# EAGLE design OhEye (EAGLE 6.2)
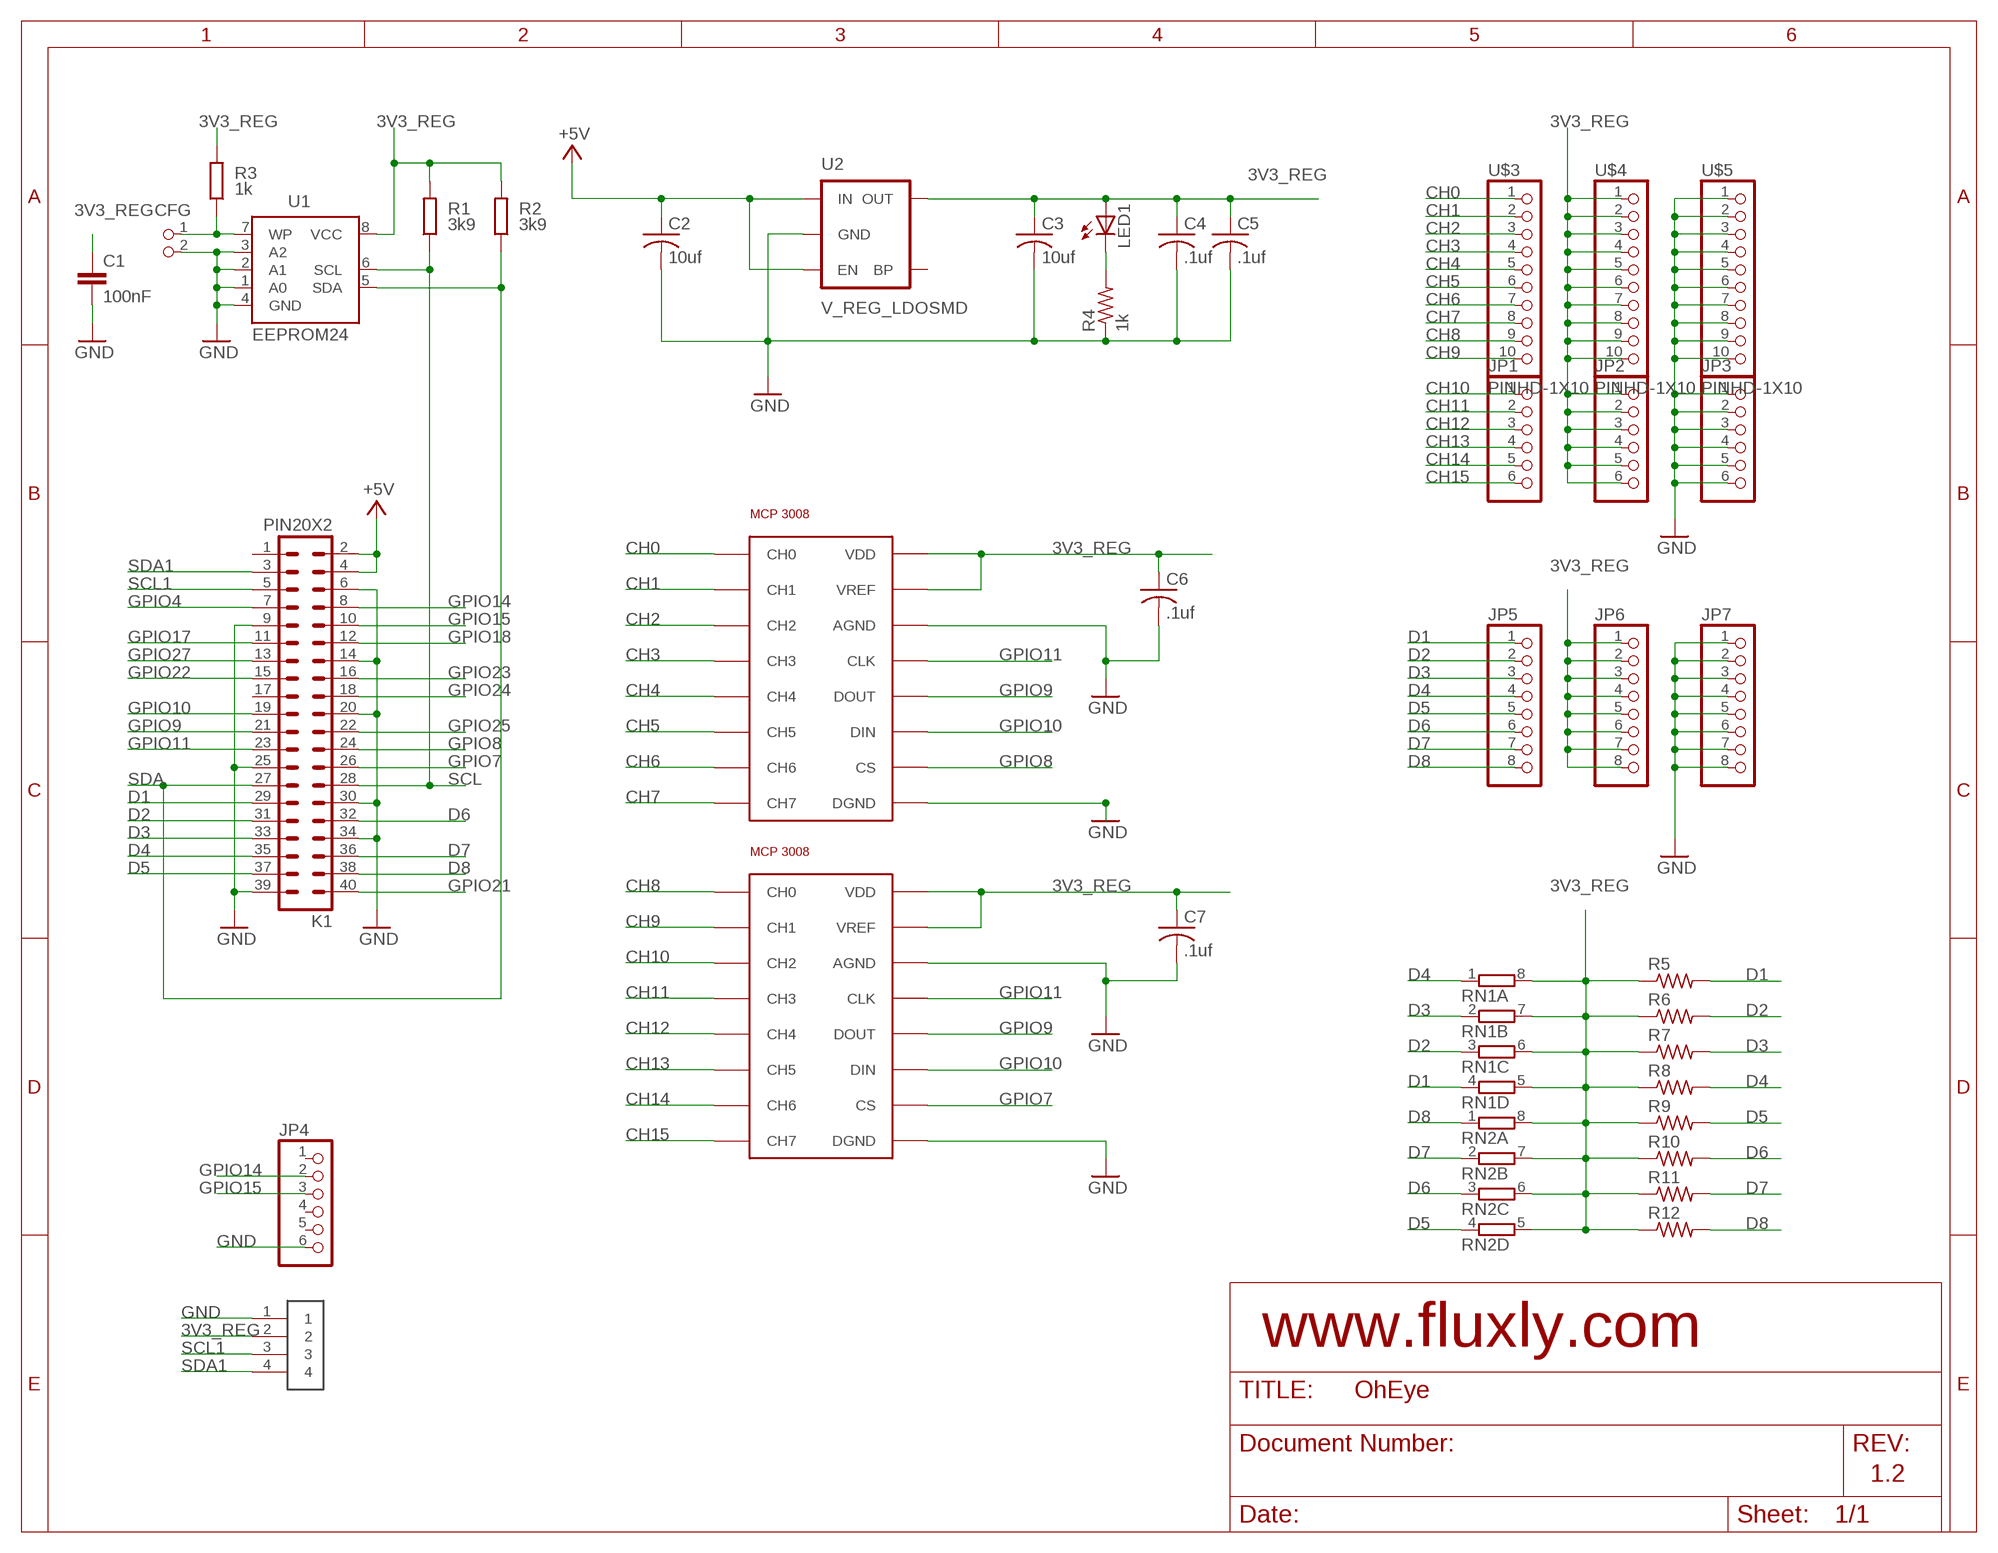
[diagram p0: schematic, sheet 1]

## Parts
C1  100nF  C-EUC0805K  [C0805K]
C2  10uf  C-USC0805K  [C0805K]
C3  10uf  C-USC0805K  [C0805K]
C4  .1uf  C-USC0805K  [C0805K]
C5  .1uf  C-USC0805K  [C0805K]
C6  .1uf  C-USC0805K  [C0805K]
C7  .1uf  C-USC0805K  [C0805K]
CFG  PIN2_100  [PIN_W_2]
JP1  PINHD-1X6B  [1X06-BIG]
JP2  PINHD-1X6B  [1X06-BIG]
JP3  PINHD-1X6B  [1X06-BIG]
JP4  PINHD-1X6B  [1X06-BIG]
JP5  PINHD-1X8BIG  [1X08-BIG]
JP6  PINHD-1X8BIG  [1X08-BIG]
JP7  PINHD-1X8BIG  [1X08-BIG]
K1  PIN20X2  [PIN_20X2]
LED1  LEDLED-0805  [LED0805.PAC]
R1  3k9  R-EU_M0805  [M0805]
R2  3k9  R-EU_M0805  [M0805]
R3  1k  R-EU_M0805  [M0805]
R4  1k  R-US_R0805W  [R0805W]
R5  R-US_0207/10  [0207/10]
R6  R-US_0207/10  [0207/10]
R7  R-US_0207/10  [0207/10]
R8  R-US_0207/10  [0207/10]
R9  R-US_0207/10  [0207/10]
R10  R-US_0207/10  [0207/10]
R11  R-US_0207/10  [0207/10]
R12  R-US_0207/10  [0207/10]
RN1  REISTOR_4NETEXBS8V  [EXBS8V]
RN2  REISTOR_4NETEXBS8V  [EXBS8V]
U1  EEPROM24  [SOIC8]
U2  V_REG_LDOSMD  [SOT23-5]
U$1  MCP3008_ADC  [SOIC16]
U$2  MCP3008_ADC  [SOIC16]
U$3  PINHD-1X10  [1X10-BIG]
U$4  PINHD-1X10  [1X10-BIG]
U$5  PINHD-1X10  [1X10-BIG]
U$9  1X4_CLEAN  [1X4_CLEAN]

## Nets
3V3_REG: C1.1 C3.1 C4.1 C5.1 C6.1 C7.1 JP2.1 JP2.2 JP2.3 JP2.4 JP2.5 JP2.6 JP6.1 JP6.2 JP6.3 JP6.4 JP6.5 JP6.6 JP6.7 JP6.8 LED1.A R1.2 R2.2 R3.2 R5.1 R6.1 R7.1 R8.1 R9.1 R10.1 R11.1 R12.1 RN1.5 RN1.6 RN1.7 RN1.8 RN2.5 RN2.6 RN2.7 RN2.8 U1.8(VCC) U2.5(OUT) U$1.P$15(VREF) U$1.P$16(VDD) U$2.P$15(VREF) U$2.P$16(VDD) U$4.1 U$4.2 U$4.3 U$4.4 U$4.5 U$4.6 U$4.7 U$4.8 U$4.9 U$4.10 U$9.2
+5V: C2.1 K1.2 K1.4 U2.1(IN) U2.3(EN)
CH0: U$1.P$1(CH0) U$3.1
CH1: U$1.P$2(CH1) U$3.2
CH2: U$1.P$3(CH2) U$3.3
CH3: U$1.P$4(CH3) U$3.4
CH4: U$1.P$5(CH4) U$3.5
CH5: U$1.P$6(CH5) U$3.6
CH6: U$1.P$7(CH6) U$3.7
CH7: U$1.P$8(CH7) U$3.8
CH8: U$2.P$1(CH0) U$3.9
CH9: U$2.P$2(CH1) U$3.10
CH10: JP1.1 U$2.P$3(CH2)
CH11: JP1.2 U$2.P$4(CH3)
CH12: JP1.3 U$2.P$5(CH4)
CH13: JP1.4 U$2.P$6(CH5)
CH14: JP1.5 U$2.P$7(CH6)
CH15: JP1.6 U$2.P$8(CH7)
D1: JP5.1 K1.29 R5.2 RN1.4
D2: JP5.2 K1.31 R6.2 RN1.3
D3: JP5.3 K1.33 R7.2 RN1.2
D4: JP5.4 K1.35 R8.2 RN1.1
D5: JP5.5 K1.37 R9.2 RN2.4
D6: JP5.6 K1.32 R10.2 RN2.3
D7: JP5.7 K1.36 R11.2 RN2.2
D8: JP5.8 K1.38 R12.2 RN2.1
GND: C1.2 C2.2 C3.2 C4.2 C5.2 C6.2 C7.2 CFG.2 JP3.1 JP3.2 JP3.3 JP3.4 JP3.5 JP3.6 JP4.6 JP7.1 JP7.2 JP7.3 JP7.4 JP7.5 JP7.6 JP7.7 JP7.8 K1.6 K1.9 K1.14 K1.20 K1.25 K1.30 K1.34 K1.39 R4.1 U1.1(A0) U1.2(A1) U1.3(A2) U1.4(GND) U2.2(GND) U$1.P$9(DGND) U$1.P$14(AGND) U$2.P$9(DGND) U$2.P$14(AGND) U$5.1 U$5.2 U$5.3 U$5.4 U$5.5 U$5.6 U$5.7 U$5.8 U$5.9 U$5.10 U$9.1
GPIO4: K1.7
GPIO7: K1.26 U$2.P$10(CS)
GPIO8: K1.24 U$1.P$10(CS)
GPIO9: K1.21 U$1.P$12(DOUT) U$2.P$12(DOUT)
GPIO10: K1.19 U$1.P$11(DIN) U$2.P$11(DIN)
GPIO11: K1.23 U$1.P$13(CLK) U$2.P$13(CLK)
GPIO14: JP4.2 K1.8
GPIO15: JP4.3 K1.10
GPIO17: K1.11
GPIO18: K1.12
GPIO21: K1.40
GPIO22: K1.15
GPIO23: K1.16
GPIO24: K1.18
GPIO25: K1.22
GPIO27: K1.13
N$3: CFG.1 R3.1 U1.7(WP)
N$8: LED1.K(C) R4.2
SCL: K1.28 R1.1 U1.6(SCL)
SCL1: K1.5 U$9.3
SDA: K1.27 R2.1 U1.5(SDA)
SDA1: K1.3 U$9.4
Unconnected: JP4.1 JP4.4 JP4.5 K1.1 K1.17 U2.4(BP)

## Notes on the sheet
- www.fluxly.com
- 1.2

## Library data of the parts
C1 = resistor:C-EU: CAPACITOR, European symbol; DIELECTRIC: X7R
C2-C7 = ModernDevice:C-US: CAPACITOR, American symbol
CFG = FLYFISH:PIN2
JP1-JP4 = adafruit:PINHD-1X6: PIN HEADER
JP5-JP7 = adafruit:PINHD-1X8: PIN HEADER
K1 = FLYFISH:PIN20X2
LED1 = ModernDevice:LED: LEDs Standard schematic elements and footprints for 5mm, 3mm, 1206, and 0603 sized LEDs. 5mm - Spark Fun Electronics SKU : COM-00529 (and others)
R1-R3 = resistor:R-EU_: RESISTOR, European symbol; TOLERANCE: 5%
R4 = ModernDevice:R-US_: RESISTOR, American symbol
R5-R12 = adafruit:R-US_: RESISTOR, American symbol
RN1 RN2 = ModernDevice:REISTOR_4NET: Array Chip Resistor Source: RS Component / Phycomp; OC_FARNELL: unknown; OC_NEWARK: unknown
U1 = FLYFISH:EEPROM24
U2 = ModernDevice:V_REG_LDO: Voltage Regulator LDO Standard 150mA LDO voltage regulator in SOT-23 layout. Micrel part MIC5205. BP (by-pass) pin is used to lower output noise with 470pF cap.
U$1 U$2 = ModernDevice:MCP3008_ADC
U$3-U$5 = adafruit:PINHD-1X10: Pin header 1x10 0.1" spacing With round pins
U$9 = ModernDevice:1X4_CLEAN

## Board
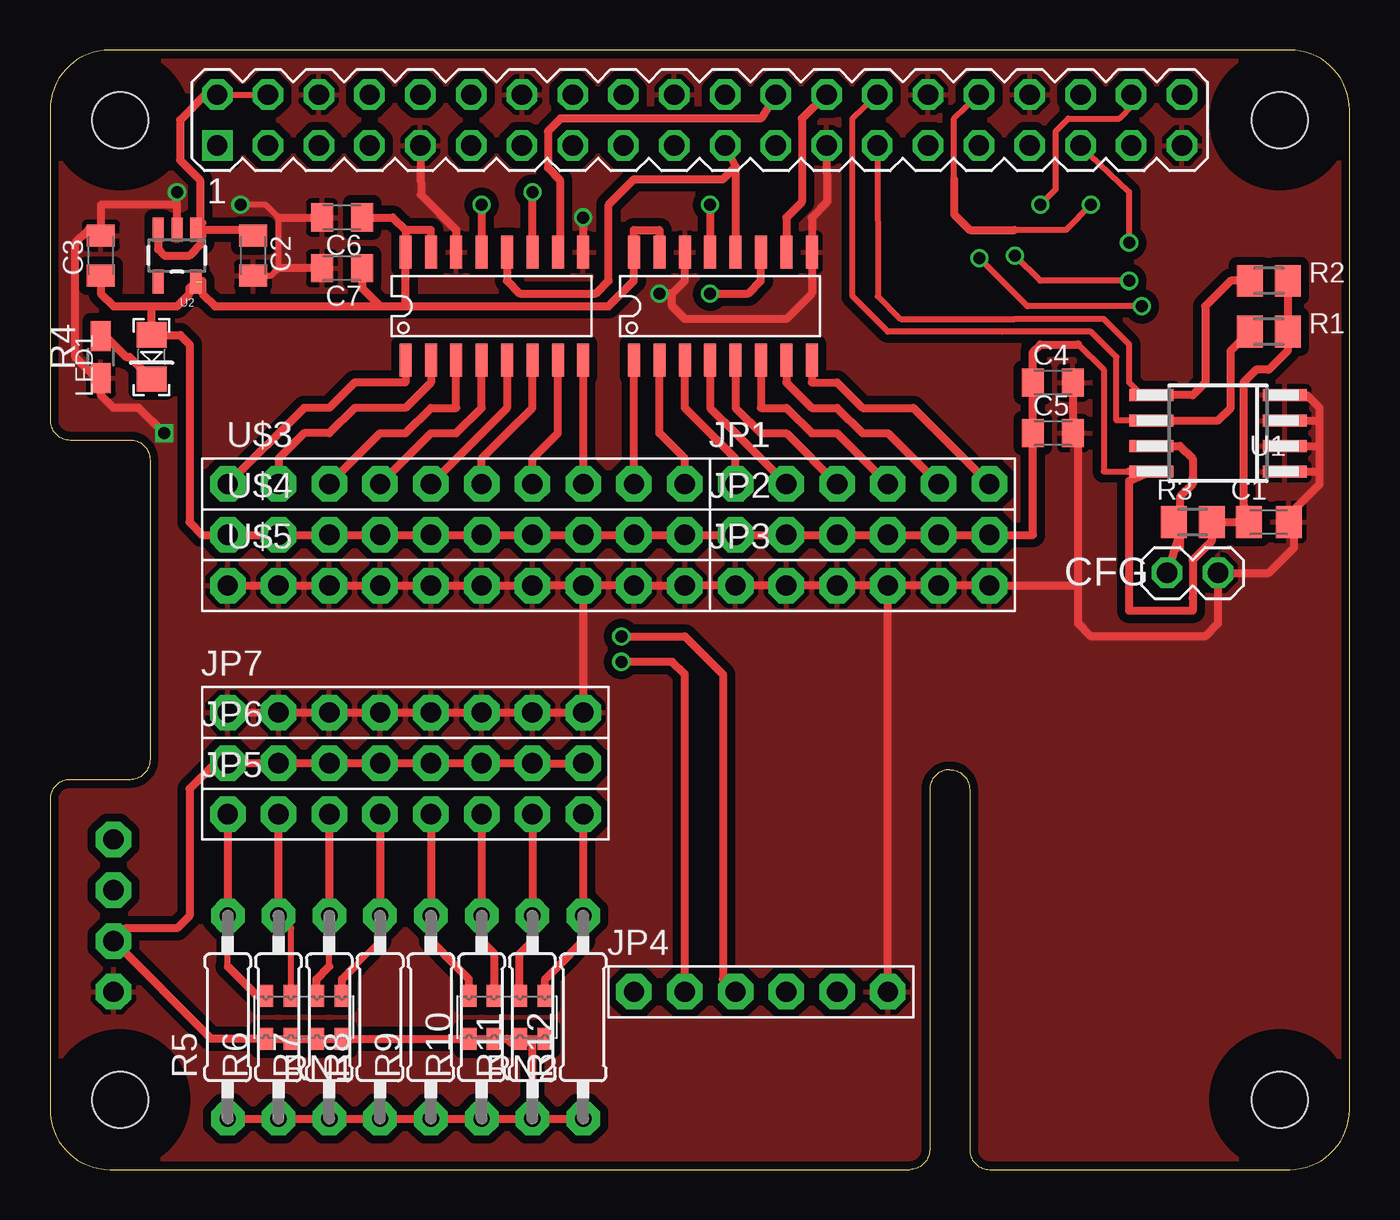
[diagram p1: board, top side]
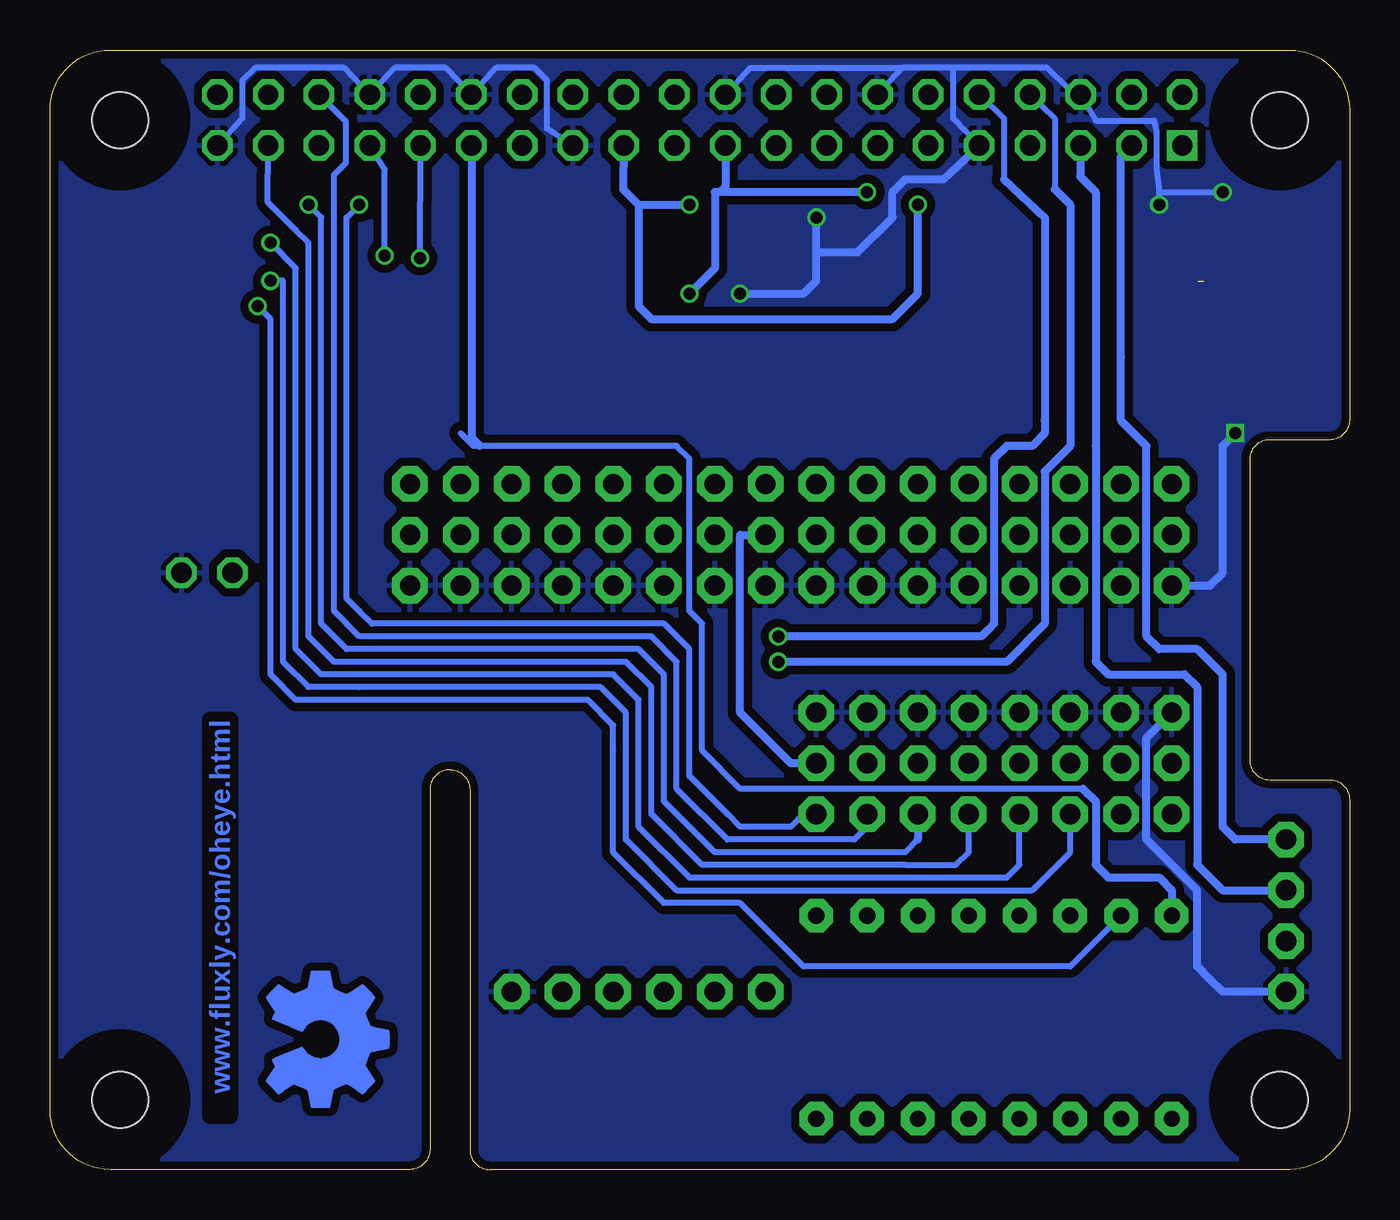
[diagram p2: board, bottom side, seen from below]

Size 65 x 56 mm. Coordinates in mm from the lower left corner, seen from the top.
Outline: 0,3 arc90 3,0 43,0 arc90 44,1 44,19 arc-90 45,20 arc-90 46,19 46,1 arc90 47,0 62,0 arc90 65,3 65,53 arc90 62,56 3,56 arc90 0,53 0,37.5 arc90 1,36.5 4,36.5 arc-90 5,35.5 5,20.5 arc-90 4,19.5 1,19.5 arc90 0,18.5 0,3
Copper layers (1*16): Top 0.035mm / dielectric 1.5mm / Bottom 0.035mm
Design rules: minimum track width 6mil, minimum drill 12mil, track to track 6mil, track to pad 6mil, pad to pad 6mil, via to via 6mil, smd to smd 0mil, copper to edge 10mil, drill to drill 10mil, minimum pad ring 10mil, minimum via ring 6mil, stop-mask expansion 10mil, vias tented up to drill 100mil, thermal gap 10mil
Holes 2.8 mm at 3.5,3.5 3.5,52.5 61.5,52.5 61.5,3.5
tRestrict: area 1.9,51 to 5,54; area 60,51 to 63,54; area 60,1.9 to 63,5; area 1.9,1.9 to 5,5
bRestrict: area 1.9,1.9 to 5,5; area 1.9,51 to 5,54; area 60,1.9 to 63,5; area 60,51 to 63,54

### Footprints (pad centres in the part's own frame; a part is rotated, then mirrored left to right if it is on the bottom)
C0805K = smd 1.3 x 1.6: 1 -1,0; 2 1,0
C0805K' = smd 1.1 x 1.4: 1 -1,0; 2 1,0
PIN_W_2 = drill 1.016 octagon: 1 0,0; 2 0,-2.54
1X06-BIG = drill 1.016 pad 1.778 octagon: 1 -6.35,0; 2 -3.81,0; 3 -1.27,0; 4 1.27,0; 5 3.81,0; 6 6.35,0
1X08-BIG = drill 1.016 pad 1.778 octagon: 1 -8.89,0; 2 -6.35,0; 3 -3.81,0; 4 -1.27,0; 5 1.27,0; 6 3.81,0; 7 6.35,0; 8 8.89,0
PIN_20X2 = drill 1.016 square: 1 -24.13,-1.27 | drill 1.016 octagon: 2 -24.13,1.27; 3 -21.59,-1.27; 4 -21.59,1.27; 5 -19.05,-1.27; 6 -19.05,1.27; 7 -16.51,-1.27; 8 -16.51,1.27; 9 -13.97,-1.27; 10 -13.97,1.27; 11 -11.43,-1.27; 12 -11.43,1.27; 13 -8.89,-1.27; 14 -8.89,1.27; 15 -6.35,-1.27; 16 -6.35,1.27; 17 -3.81,-1.27; 18 -3.81,1.27; 19 -1.27,-1.27; 20 -1.27,1.27; 21 1.27,-1.27; 22 1.27,1.27; 23 3.81,-1.27; 24 3.81,1.27; 25 6.35,-1.27; 26 6.35,1.27; 27 8.89,-1.27; 28 8.89,1.27; 29 11.43,-1.27; 30 11.43,1.27; 31 13.97,-1.27; 32 13.97,1.27; 33 16.51,-1.27; 34 16.51,1.27; 35 19.05,-1.27; 36 19.05,1.27; 37 21.59,-1.27; 38 21.59,1.27; 39 24.13,-1.27; 40 24.13,1.27
LED0805.PAC = smd 1.27 x 1.5: A 1.104,0; K -1.104,0
M0805 = smd 1.3 x 1.6: 1 -0.95,0; 2 0.95,0
R0805W = smd 1.5 x 1: 1 -1.052,0; 2 1.052,0
0207/10 = drill 0.813 pad 1.676 octagon: 1 -5.08,0; 2 5.08,0
EXBS8V = smd 0.75 x 1.1: 1 -1.905,-1.07; 2 -0.635,-1.07; 3 0.635,-1.07; 4 1.905,-1.07; 5 1.905,1.07; 6 0.635,1.07; 7 -0.635,1.07; 8 -1.905,1.07
SOIC8 = smd 0.6 x 2.2: 1 -1.905,-3.33; 2 -0.635,-3.33; 3 0.635,-3.33; 4 1.905,-3.33; 5 1.905,3.33; 6 0.635,3.33; 7 -0.635,3.33; 8 -1.905,3.33
SOT23-5 = smd 0.55 x 1.2: 1 -0.95,-1.3; 2 0,-1.3; 3 0.95,-1.3; 4 0.95,1.3; 5 -0.95,1.3
SOIC16 = smd 1.65 x 0.6: P$1 -2.7,3.81; P$2 -2.7,2.54; P$3 -2.7,1.27; P$4 -2.7,0; P$5 -2.7,-1.27; P$6 -2.7,-2.54; P$7 -2.7,-3.81; P$8 -2.7,-5.08; P$9 2.7,-5.08; P$10 2.7,-3.81; P$11 2.7,-2.54; P$12 2.7,-1.27; P$13 2.7,0; P$14 2.7,1.27; P$15 2.7,2.54; P$16 2.7,3.81
1X10-BIG = drill 1.016 pad 1.778 octagon: 1 -11.43,0; 2 -8.89,0; 3 -6.35,0; 4 -3.81,0; 5 -1.27,0; 6 1.27,0; 7 3.81,0; 8 6.35,0; 9 8.89,0; 10 11.43,0
1X4_CLEAN = drill 1.016 pad 1.778 octagon: 1 -3.81,0; 2 -1.27,0; 3 1.27,0; 4 3.81,0

### Placement (x,y rotation side)
C1  60.96,32.38 0 top
C2  10uf  [C0805K']  10.16,45.72 270 top
C3  10uf  [C0805K']  2.54,45.72 90 top
C4  .1uf  [C0805K']  50.16,39.37 0 top
C5  .1uf  [C0805K']  50.16,36.83 0 top
C6  .1uf  [C0805K']  14.61,47.62 180 top
C7  .1uf  [C0805K']  14.61,45.09 180 top
CFG  55.88,29.84 90 top
JP1  40.64,34.29 0 top
JP2  40.64,31.75 0 top
JP3  40.64,29.21 0 top
JP4  35.56,8.89 0 top
JP5  17.78,17.78 0 top
JP6  17.78,20.32 0 top
JP7  17.78,22.86 0 top
K1  32.49,52.49 0 top
LED1  5.08,40.64 90 top
R1  60.96,41.91 0 top
R2  60.96,44.45 0 top
R3  57.15,32.38 0 top
R4  2.54,40.64 90 top
R5  8.89,7.62 90 top
R6  11.43,7.62 90 top
R7  13.97,7.62 90 top
R8  16.51,7.62 90 top
R9  19.05,7.62 90 top
R10  21.59,7.62 90 top
R11  24.13,7.62 90 top
R12  26.67,7.62 90 top
RN1  12.7,7.62 180 top
RN2  22.86,7.62 180 top
U1  58.42,36.83 90 top
U2  6.35,45.72 180 top
U$1  21.59,43.18 90 top
U$2  33.02,43.18 90 top
U$3  20.32,34.29 0 top
U$4  20.32,31.75 0 top
U$5  20.32,29.21 0 top
U$9  3.17,12.7 90 top

### Tracks (layer width: path | path; a pad name or v marks a point on that pad's centre or on a via)
3V3_REG  (1 unrouted)
  Top 0.305: 51.44,41.27 52.7,40.01 52.7,34.92 53.98,34.92
  Top 0.406: JP6.8 JP6.7 JP6.6 JP6.5 JP6.4 JP6.3 JP6.2 JP6.1 8.26,20.32 6.99,19.05 6.99,12.7 6.35,12.06 3.81,12.06 U$9.2 8.05,6.55 RN1.5 RN1.6 RN1.7 RN1.8 RN2.5 RN2.6 22.86,6.55 | 22.86,6.55 RN2.7 RN2.8 | R11.1 24.13,6.35 23.06,6.35 22.86,6.55 | R5.1 R6.1 R7.1 R8.1 R9.1 R10.1 R11.1 | R11.1 R12.1 | C3.1 2.54,43.81 3.17,43.18 5.08,43.18 | 5.08,43.18 6.35,43.18 6.99,43.81 6.99,44.1 U2.5 | LED1.A 5.08,41.91 | 5.08,41.91 5.08,43.18 | LED1.A 5.08,41.91 | 7.59,44.42 7.62,44.45 7.62,43.81 8.26,43.18 16.51,43.18 | 16.51,43.18 17.78,43.18 | 17.78,43.18 27.94,43.18 29.21,44.45 U$2.P$16 29.21,46.99 30.48,46.99 U$2.P$15 | 51.44,41.27 49.53,41.27 49.16,40.91 C4.1 C5.1 49.16,31.75 JP2.6 JP2.5 JP2.4 JP2.3 JP2.2 JP2.1 U$4.10 U$4.9 U$4.8 U$4.7 U$4.6 U$4.5 U$4.4 U$4.3 U$4.2 U$4.1 7.62,31.75 6.99,32.38 6.99,41.27 6.52,41.74 LED1.A | 53.98,34.92 U1.8 53.98,34.45 53.98,29.84 53.98,27.94 57.15,27.94 57.15,28.57 57.15,30.48 57.78,31.11 58.1,31.43 R3.2 C1.1 59.69,33.29 59.69,39.37 60.33,40.01 60.96,40.01 61.91,40.95 R1.2 R2.2 | U$1.P$15 19.05,46.35 19.05,46.99 17.78,46.99 | 17.78,46.99 U$1.P$16 17.78,43.18 | C6.1 17.14,47.62 17.78,46.99 | C7.1 15.61,44.09 16.51,43.18
  Bottom 0.406: JP6.8 27.94,20.32 30.48,22.86 30.48,31.75 U$4.9
+5V
  Top 0.305: K1.2 K1.4
  Top 0.406: 7.62,47.34 U2.1 | U2.1 9.86,47.02 C2.1 | U2.3 5.4,46.03 5.71,45.72 6.99,45.72 7.62,46.35 7.62,46.7 U2.1 | K1.2 7.76,53.76 6.5,52.5 6.5,50.5 7.5,49.5 7.5,47.22 U2.1
CH0
  Top 0.406: U$1.P$1 17.78,39.37 15.24,39.37 13.97,38.1 12.7,38.1 U$3.1
CH1
  Top 0.406: U$1.P$2 19.05,39.37 17.78,38.1 15.24,38.1 13.97,36.83 12.7,36.83 11.43,35.56 U$3.2
CH2
  Top 0.406: U$3.3 16.51,36.83 17.78,36.83 19.05,38.1 20.32,38.1 U$1.P$3
CH3
  Top 0.406: U$3.4 19.05,36.83 20.32,36.83 21.59,38.1 U$1.P$4
CH4
  Top 0.406: U$1.P$5 22.86,38.1 U$3.5
CH5
  Top 0.406: U$3.6 21.59,35.56 22.86,36.83 24.13,38.1 U$1.P$6
CH6
  Top 0.406: U$3.7 24.13,35.56 25.4,36.83 U$1.P$7
CH7
  Top 0.406: U$1.P$8 U$3.8
CH8
  Top 0.406: U$3.9 U$2.P$1
CH9
  Top 0.406: U$3.10 31.75,35.56 30.48,36.83 U$2.P$2
CH10
  Top 0.406: JP1.1 34.29,35.56 31.75,38.1 U$2.P$3
CH11
  Top 0.406: U$2.P$4 33.02,38.1 34.29,36.83 JP1.2
CH12
  Top 0.406: U$2.P$5 34.29,38.1 35.56,36.83 36.83,36.83 JP1.3
CH13
  Top 0.406: U$2.P$6 35.56,38.1 36.83,38.1 38.1,36.83 39.37,36.83 JP1.4
CH14
  Top 0.406: U$2.P$7 36.83,39.37 38.1,38.1 39.37,38.1 40.64,36.83 41.91,36.83 JP1.5
CH15
  Top 0.406: U$2.P$8 38.1,39.37 39.37,39.37 40.64,38.1 43.18,38.1 JP1.6
D1
  Top 0.305: 8.89,10.16 R5.2
  Top 0.406: JP5.1 R5.2 | RN1.4 10.36,8.69 8.89,10.16
  Bottom 0.305: 13.34,19.05 30.48,19.05 32.38,20.95 32.38,27.3 33.02,27.94 33.02,35.56 33.66,36.2 43.5,36.2 43.81,36.2 44.45,36.83
  Bottom 0.406: 13.34,19.05 12.7,18.41 12.7,15.24 12.06,14.61 9.53,14.61 8.89,13.97 R5.2 | K1.29 43.92,36.62 43.5,36.2
D2  (via drill 0.6)
  Top 0.305: RN1.3 12.06,12.06 R6.2 | v54.61,43.18 48.9,43.18 v46.49,45.59
  Top 0.406: R6.2 JP5.2
  Bottom 0.305: R6.2 13.97,10.16 27.3,10.16 30.48,13.34 34.29,13.34 36.83,15.88 36.83,20.95 36.83,22.23 38.1,23.5 52.7,23.5 53.98,24.77 53.98,42.55 v54.61,43.18 | v46.49,45.59 K1.31
D3  (via drill 0.6)
  Top 0.305: 13.97,10.16 R7.2 | v53.98,44.45 49.53,44.45 v48.26,45.72
  Top 0.406: JP5.3 R7.2 | RN1.2 13.34,9.53 13.97,10.16
  Bottom 0.305: JP5.3 13.97,15.88 15.88,13.97 33.66,13.97 36.2,16.51 36.2,22.86 37.47,24.13 49.53,24.13 52.07,24.13 53.34,25.4 53.34,44.45 v53.98,44.45 | v48.26,45.72 48.26,50.03 K1.33
D4  (via drill 0.6)
  Top 0.305: 15.24,10.16 16.51,11.43 R8.2 | v53.98,46.35 53.98,48.9 K1.35
  Top 0.406: JP5.4 R8.2 | RN1.1 14.61,9.53 15.24,10.16
  Bottom 0.305: 49.53,24.77 36.83,24.77 35.56,23.5 35.56,17.14 33.02,14.61 17.78,14.61 17.14,14.61 16.51,15.24 JP5.4 | 49.53,24.77 51.44,24.77 | 49.53,24.77 51.44,24.77 | 51.44,24.77 52.7,26.04 52.7,45.09 v53.98,46.35
D5
  Top 0.406: JP5.5 R9.2 19.05,11.43 20.32,10.16 20.95,9.53 RN2.4
  Bottom 0.305: K1.37 54.11,48.4 52.7,46.99 52.07,46.35 52.07,26.67 50.8,25.4 50.16,25.4 36.2,25.4 34.92,24.13 34.92,17.78 32.38,15.24 22.23,15.24 19.68,15.24 19.05,15.88 JP5.5
D6  (via drill 0.6)
  Top 0.305: v52.07,48.26 50.8,46.99 48.26,46.99 | 45.22,49.53 45.22,52.57 K1.32
  Top 0.406: JP5.6 R10.2 21.59,11.43 22.23,10.79 RN2.3 | 45.22,49.53 45.22,47.78 46,47 48.25,47 48.26,46.99
  Bottom 0.305: 21.59,16.51 22.23,15.88 31.75,15.88 34.29,18.41 34.29,24.77 35.56,26.04 50.16,26.04 51.44,27.3 51.44,47.62 v52.07,48.26
  Bottom 0.406: JP5.6 21.59,16.51
D7
  Top 0.406: JP5.7 R11.2 24.13,11.43 23.5,10.79 RN2.2
  Bottom 0.305: 24.13,17.14 24.77,16.51 31.11,16.51 33.66,19.05 33.66,25.4 34.92,26.67 49.53,26.67 50.8,27.94 50.8,48.57 50.8,49.76 50.19,50.37 50.19,52.41 K1.36
  Bottom 0.406: JP5.7 24.13,17.14
D8  (via drill 0.6)
  Top 0.305: v49.53,48.26 50.3,49.03 50.3,51.94 50.94,52.57 53.48,52.57 54.11,53.2 K1.38
  Top 0.406: JP5.8 R12.2 26.67,11.43 25.4,10.16 24.77,9.53 RN2.1
  Bottom 0.305: JP5.8 27.3,17.78 27.94,17.14 30.48,17.14 31.11,17.78 33.02,19.68 33.02,26.04 34.29,27.3 48.9,27.3 49.53,27.94 50.16,28.57 50.16,47.62 v49.53,48.26
GND  (via drill 0.6)
  Top 0.305: v6.35,48.9 6.35,48.26 | C2.2 11.06,44.72 11.43,45.09 11.43,47.62 10.79,48.26 v9.53,48.26
  Top 0.406: C4.2 C5.2 51.44,36.56 51.44,29.21 | JP3.4 JP3.5 JP3.6 51.44,29.21 | JP3.4 JP3.3 JP3.2 JP3.1 U$5.10 U$5.9 U$5.8 | U$5.8 U$5.7 22.86,29.21 U$5.5 U$5.4 U$5.3 U$5.2 U$5.1 | JP7.1 JP7.2 JP7.3 JP7.4 JP7.5 JP7.6 JP7.7 JP7.8 U$5.8 | K1.9 18.55,48.76 20.32,46.99 U$1.P$14 20.32,45.72 | U2.2 6.35,48.26 2.54,48.26 C3.2 2.27,46.99 1.91,46.99 1.27,46.35 1.27,40.64 2.32,39.59 R4.1 2.54,38.73 3.17,38.1 4.45,38.1 v5.71,36.83 | K1.25 38.87,48.4 38.1,47.62 U$2.P$9 38.1,43.81 36.83,42.55 31.75,42.55 31.11,43.18 31.11,43.81 | 31.11,43.81 31.75,44.45 31.75,45.72 | 31.75,45.72 U$2.P$14 31.75,45.72 | 63.5,34.92 63.5,34.29 62.23,33.02 C1.2 62.23,32.12 62.23,31.11 60.96,29.84 CFG.2 58.42,27.3 57.78,26.67 52.07,26.67 51.44,27.3 51.44,29.21 | 63.5,34.92 63.5,36.2 | 63.5,36.2 63.5,37.47 | 63.5,37.47 63.5,38.1 62.87,38.73 U1.4 | U1.3 63.5,37.47 | U1.2 63.5,36.2 | U1.1 63.5,34.92 | 31.11,43.81 v30.48,43.81 | v26.67,47.62 U$1.P$9 | C7.2 11.43,45.09 | 11.43,47.62 C6.2 | JP4.6 JP3.4
  Bottom 0.305: K1.39 55.38,52.57 55.38,54.48 54.74,55.11 50.3,55.11 K1.34 47.76,55.11 45.22,55.11 K1.30 42.68,55.11 40.77,55.11 40.14,54.48 40.14,52.07 K1.25 | 19.82,55.11 15.11,55.11 13.97,53.98 K1.6 12.69,52.47 9.79,52.47 9.66,51.94 9.66,50.03 9.53,48.9 | 19.82,55.11 22.36,55.11 | 22.36,55.11 K1.14 | K1.20 29.98,55.11 22.36,55.11 | K1.9 19.82,52.57 19.82,55.11 | 9.53,48.9 v6.35,48.9 | v9.53,48.26 9.53,48.9
  Bottom 0.406: U$9.1 5.71,8.89 6.35,8.89 6.99,9.53 7.62,10.16 7.62,13.97 10.16,16.51 10.16,21.59 JP7.1 | U$5.1 6.99,29.21 6.35,29.84 6.35,36.2 v5.71,36.83 | v30.48,43.81 27.3,43.81 26.67,44.45 U$1.P$9 | U$1.P$9 v26.67,47.62 | U$1.P$9 24.61,45.88 22.86,47.62 22.86,48.9 22.23,49.53 20.32,49.53 K1.9
  pour Bottom (isolate 0.406): 0,3 arc90 3,0 43,0 arc90 44,1 44,19 arc-90 45,20 arc-90 46,19 46,1 arc90 47,0 62,0 arc90 65,3 65,53 arc90 62,56 3,56 arc90 0,53 0,37.5 arc90 1,36.5 4,36.5 arc-90 5,35.5 5,20.5 arc-90 4,19.5 1,19.5 arc90 0,18.5
  pour Top (isolate 0.406): 0,3 arc90 3,0 43,0 arc90 44,1 44,19 arc-90 45,20 arc-90 46,19 46,1 arc90 47,0 62,0 arc90 65,3 65,53 arc90 62,56 3,56 arc90 0,53 0,37.5 arc90 1,36.5 4,36.5 arc-90 5,35.5 5,20.5 arc-90 4,19.5 1,19.5 arc90 0,18.5
GPIO7
  Top 0.406: K1.26 37.6,52.57 37.6,48.4 36.83,47.62 U$2.P$10
GPIO8
  Top 0.406: K1.24 35.56,52.57 25.54,52.57 24.9,51.94 24.9,50.1 25.5,49.5 25.5,45.98 U$1.P$10
GPIO9
  Top 0.406: K1.21 34.29,50.16 | 34.29,50.16 34.29,46.35 | 34.29,46.35 U$2.P$12 34.29,46.35 | U$1.P$12 22.86,44.45 23.5,43.81 27.3,43.81 27.94,44.45 27.94,48.26 29.21,49.53 33.66,49.53 34.29,50.16
GPIO10  (via drill 0.6)
  Top 0.406: v33.02,43.81 34.92,43.81 35.56,44.45 U$2.P$11 | U$1.P$11 v24.13,48.9
  Bottom 0.406: v33.02,43.81 31.75,45.09 31.75,48.9 31.5,48.9 | v24.13,48.9 31.11,48.9 31.5,48.9 | K1.19 31.23,49.17 31.5,48.9
GPIO11  (via drill 0.6)
  Top 0.406: v33.02,48.26 U$2.P$13 33.02,45.72 | v21.59,48.26 U$1.P$13
  Bottom 0.406: 35.56,48.26 36.33,49.03 K1.23 | 35.56,48.26 35.56,43.18 34.92,42.55 22.86,42.55 21.59,43.81 v21.59,48.26 | 35.56,48.26 v33.02,48.26
GPIO14  (via drill 0.6)
  Top 0.406: JP4.2 31.75,24.13 31.75,24.77 31.11,25.4 v28.57,25.4
  Bottom 0.305: K1.8 14.74,52.57 14.74,49.03
  Bottom 0.406: 14.74,49.03 13.97,48.26 13.97,36.2 15.24,34.92 15.24,27.3 17.14,25.4 v28.57,25.4
GPIO15  (via drill 0.6)
  Top 0.406: v28.57,26.67 31.75,26.67 33.66,24.77 33.66,9.53 JP4.3
  Bottom 0.305: K1.10 17.28,52.57 17.28,49.53
  Bottom 0.406: 17.28,49.53 15.24,47.62 15.24,37.47 15.24,36.83 15.88,36.2 17.14,36.2 17.78,35.56 17.78,27.3 | 17.78,27.3 18.1,26.99 | 18.1,26.99 18.41,26.67 v28.57,26.67 | 17.78,27.3 18.1,26.99
N$3
  Top 0.406: CFG.1 56.52,31.75 | 56.52,31.75 56.52,31.11 56.52,31.75 | 56.52,31.75 56.52,32.7 R3.1 56.52,32.7 56.52,33.66 57.15,34.29 57.15,34.6 57.15,35.56 56.52,36.2 U1.7
N$8
  Top 0.406: R4.2 2.76,41.69 3.81,40.64 3.98,40.64 LED1.K
SCL
  Top 0.305: U1.6 53.34,37.47 53.34,40.64 52.07,41.91 47.62,41.91 41.91,41.91 40.14,43.68 40.14,52.57 K1.28
  Top 0.406: U1.6 58.42,37.47 59.05,38.1 59.05,40.95 R1.1
SCL1
  Bottom 0.406: K1.5 13.47,49.66 12.7,48.9 12.7,36.2 12.7,25.4 12.06,24.77 8.26,24.77 7.62,24.13 7.62,15.24 6.35,13.97 U$9.3
SDA
  Top 0.305: U1.5 54.61,38.73 53.98,39.37 53.98,41.27 52.7,42.55 48.26,42.55 42.55,42.55 41.41,43.68 K1.27
  Top 0.406: R2.1 59.05,44.45 57.78,43.18 57.78,39.37 57.15,38.73 U1.5
SDA1
  Bottom 0.406: U$9.4 5.71,16.51 6.35,17.14 6.35,24.77 7.62,26.04 9.53,26.04 10.16,26.67 10.16,36.2 11.43,37.47 11.43,40.64 11.43,50.7 K1.3
(copper drawn outside any net)
  shapes: Bottom area x394

### Text on the board
Bottom: www.fluxly.com/oheye.html
bStop: www.fluxly.com/oheye.html